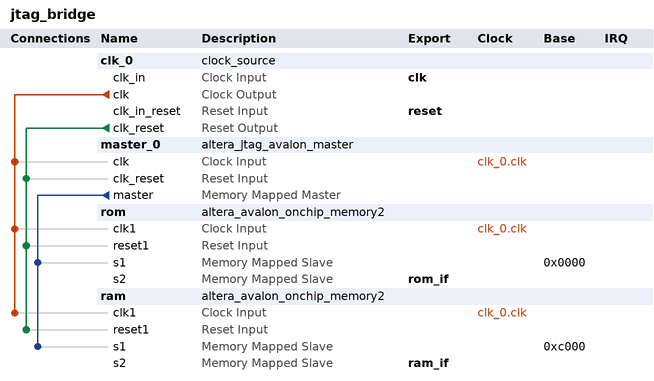
[diagram p0: system contents]
# Platform Designer (Qsys) system jtag_bridge, Cyclone 10 LP 10CL025YU256I7G
# Parameters at their usual value, and those the tool derives, are not listed.
package require -exact qsys 19.1
create_system jtag_bridge
set_project_property DEVICE_FAMILY {Cyclone 10 LP}
set_project_property DEVICE 10CL025YU256I7G

add_instance clk_0 clock_source 19.1
set_instance_parameter_value clk_0 clockFrequency 50000000

add_instance master_0 altera_jtag_avalon_master 19.1

add_instance rom altera_avalon_onchip_memory2 19.1
set_instance_parameter_value rom dataWidth 32
set_instance_parameter_value rom dualPort true
set_instance_parameter_value rom initMemContent true
set_instance_parameter_value rom initializationFileName /home/matan/projects/matank-ibex/ibex/examples/sw/led/led.hex
set_instance_parameter_value rom instanceID 111
set_instance_parameter_value rom memorySize 20000
set_instance_parameter_value rom resetrequest_enabled false
set_instance_parameter_value rom singleClockOperation true
set_instance_parameter_value rom useNonDefaultInitFile true

add_instance ram altera_avalon_onchip_memory2 19.1
set_instance_parameter_value ram dataWidth 32
set_instance_parameter_value ram dualPort true
set_instance_parameter_value ram initMemContent true
set_instance_parameter_value ram initializationFileName onchip_mem.hex
set_instance_parameter_value ram memorySize 10000
set_instance_parameter_value ram resetrequest_enabled false
set_instance_parameter_value ram singleClockOperation true

# connections
add_connection clk_0.clk master_0.clk clock
add_connection clk_0.clk ram.clk1 clock
add_connection clk_0.clk rom.clk1 clock
add_connection clk_0.clk_reset master_0.clk_reset reset
add_connection clk_0.clk_reset ram.reset1 reset
add_connection clk_0.clk_reset rom.reset1 reset
add_connection master_0.master ram.s1 avalon
set_connection_parameter_value master_0.master/ram.s1 baseAddress 0xc000
add_connection master_0.master rom.s1 avalon
set_connection_parameter_value master_0.master/rom.s1 baseAddress 0x0000

# exported interfaces
add_interface clk clock sink
set_interface_property clk EXPORT_OF clk_0.clk_in
add_interface ram_if avalon slave
set_interface_property ram_if EXPORT_OF ram.s2
add_interface reset reset sink
set_interface_property reset EXPORT_OF clk_0.clk_in_reset
add_interface rom_if avalon slave
set_interface_property rom_if EXPORT_OF rom.s2

set_interconnect_requirement {$system} qsys_mm.clockCrossingAdapter HANDSHAKE
set_interconnect_requirement {$system} qsys_mm.enableEccProtection FALSE
set_interconnect_requirement {$system} qsys_mm.insertDefaultSlave FALSE
set_interconnect_requirement {$system} qsys_mm.maxAdditionalLatency 1

save_system jtag_bridge.qsys
